# Altium schematic sheet 14 SENSORS.SchDoc
size 513 x 386 mm
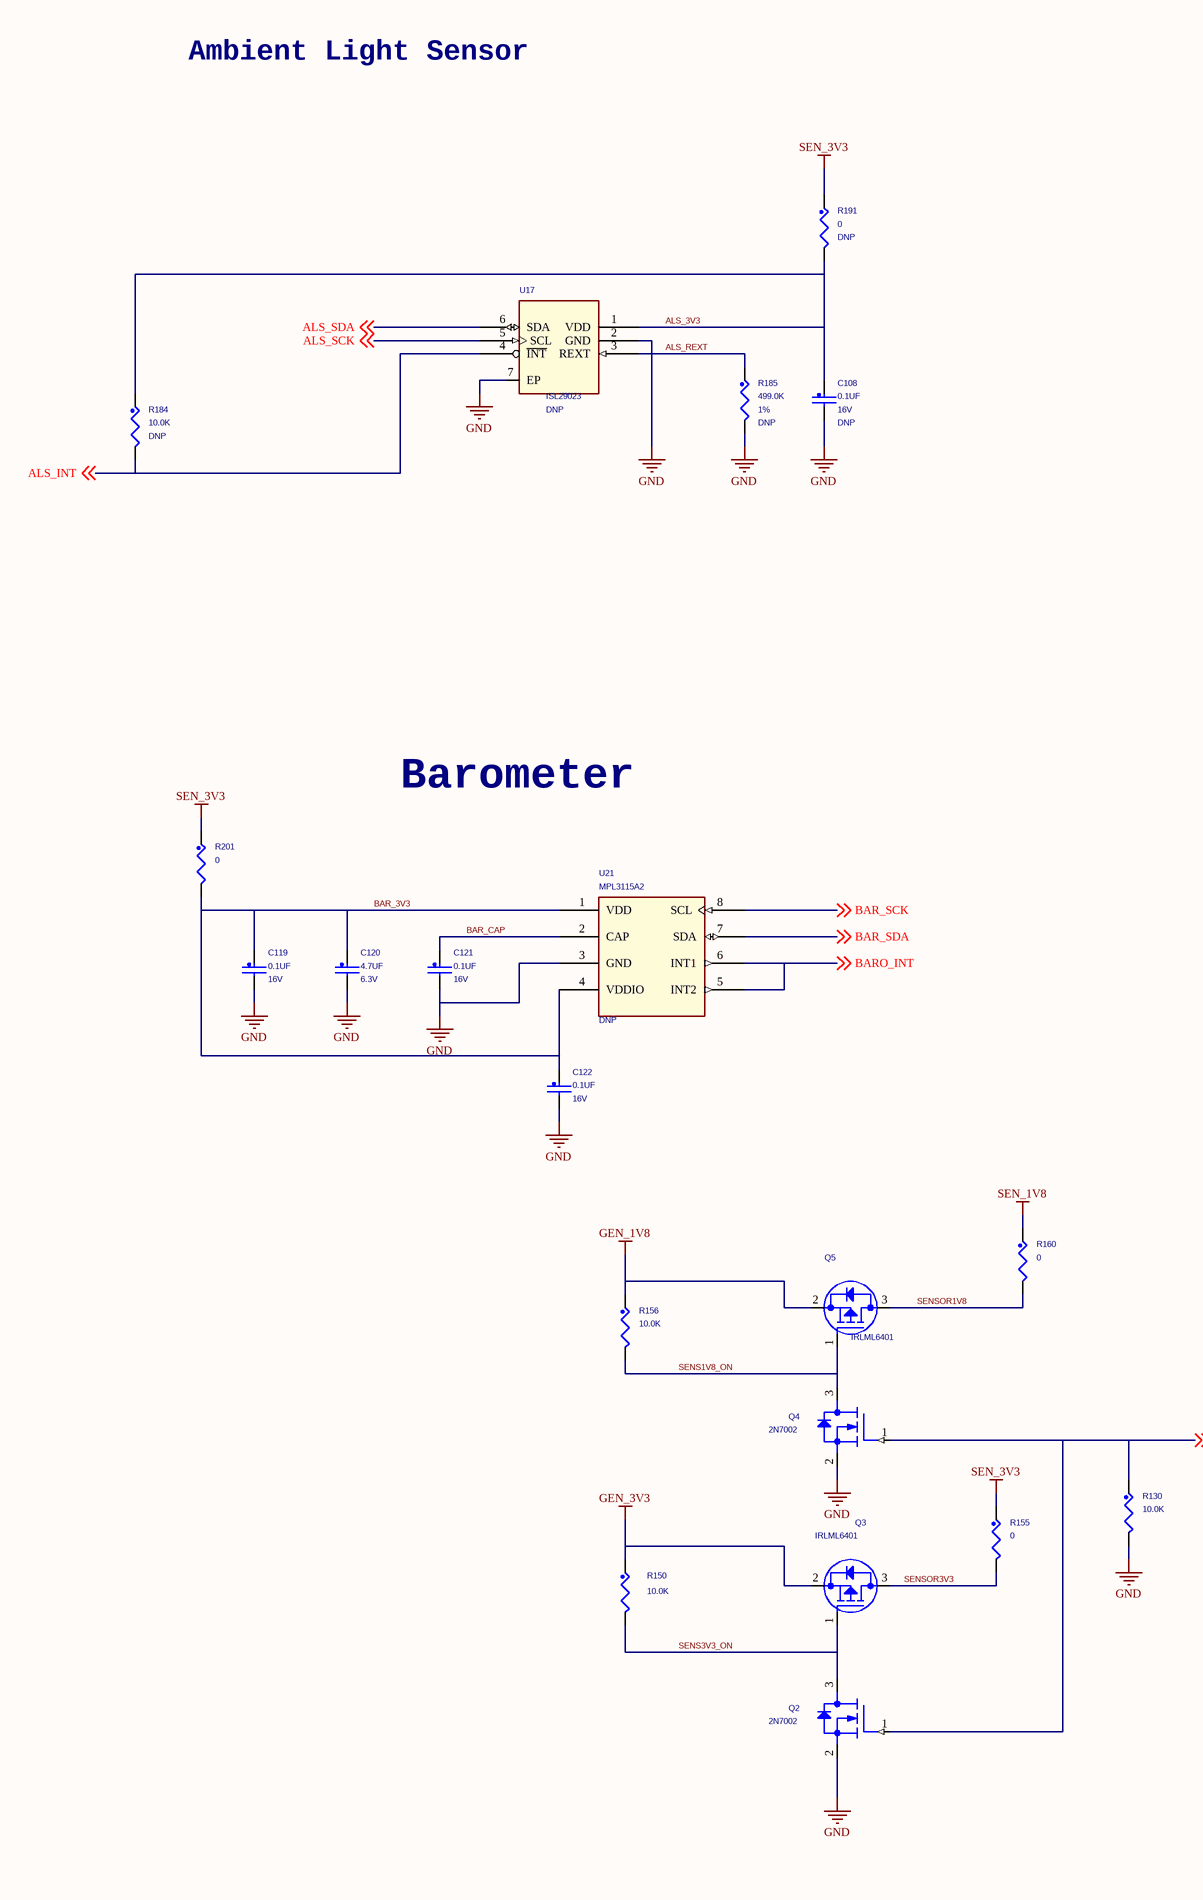
[diagram p0: 14 SENSORS.SchDoc, left]
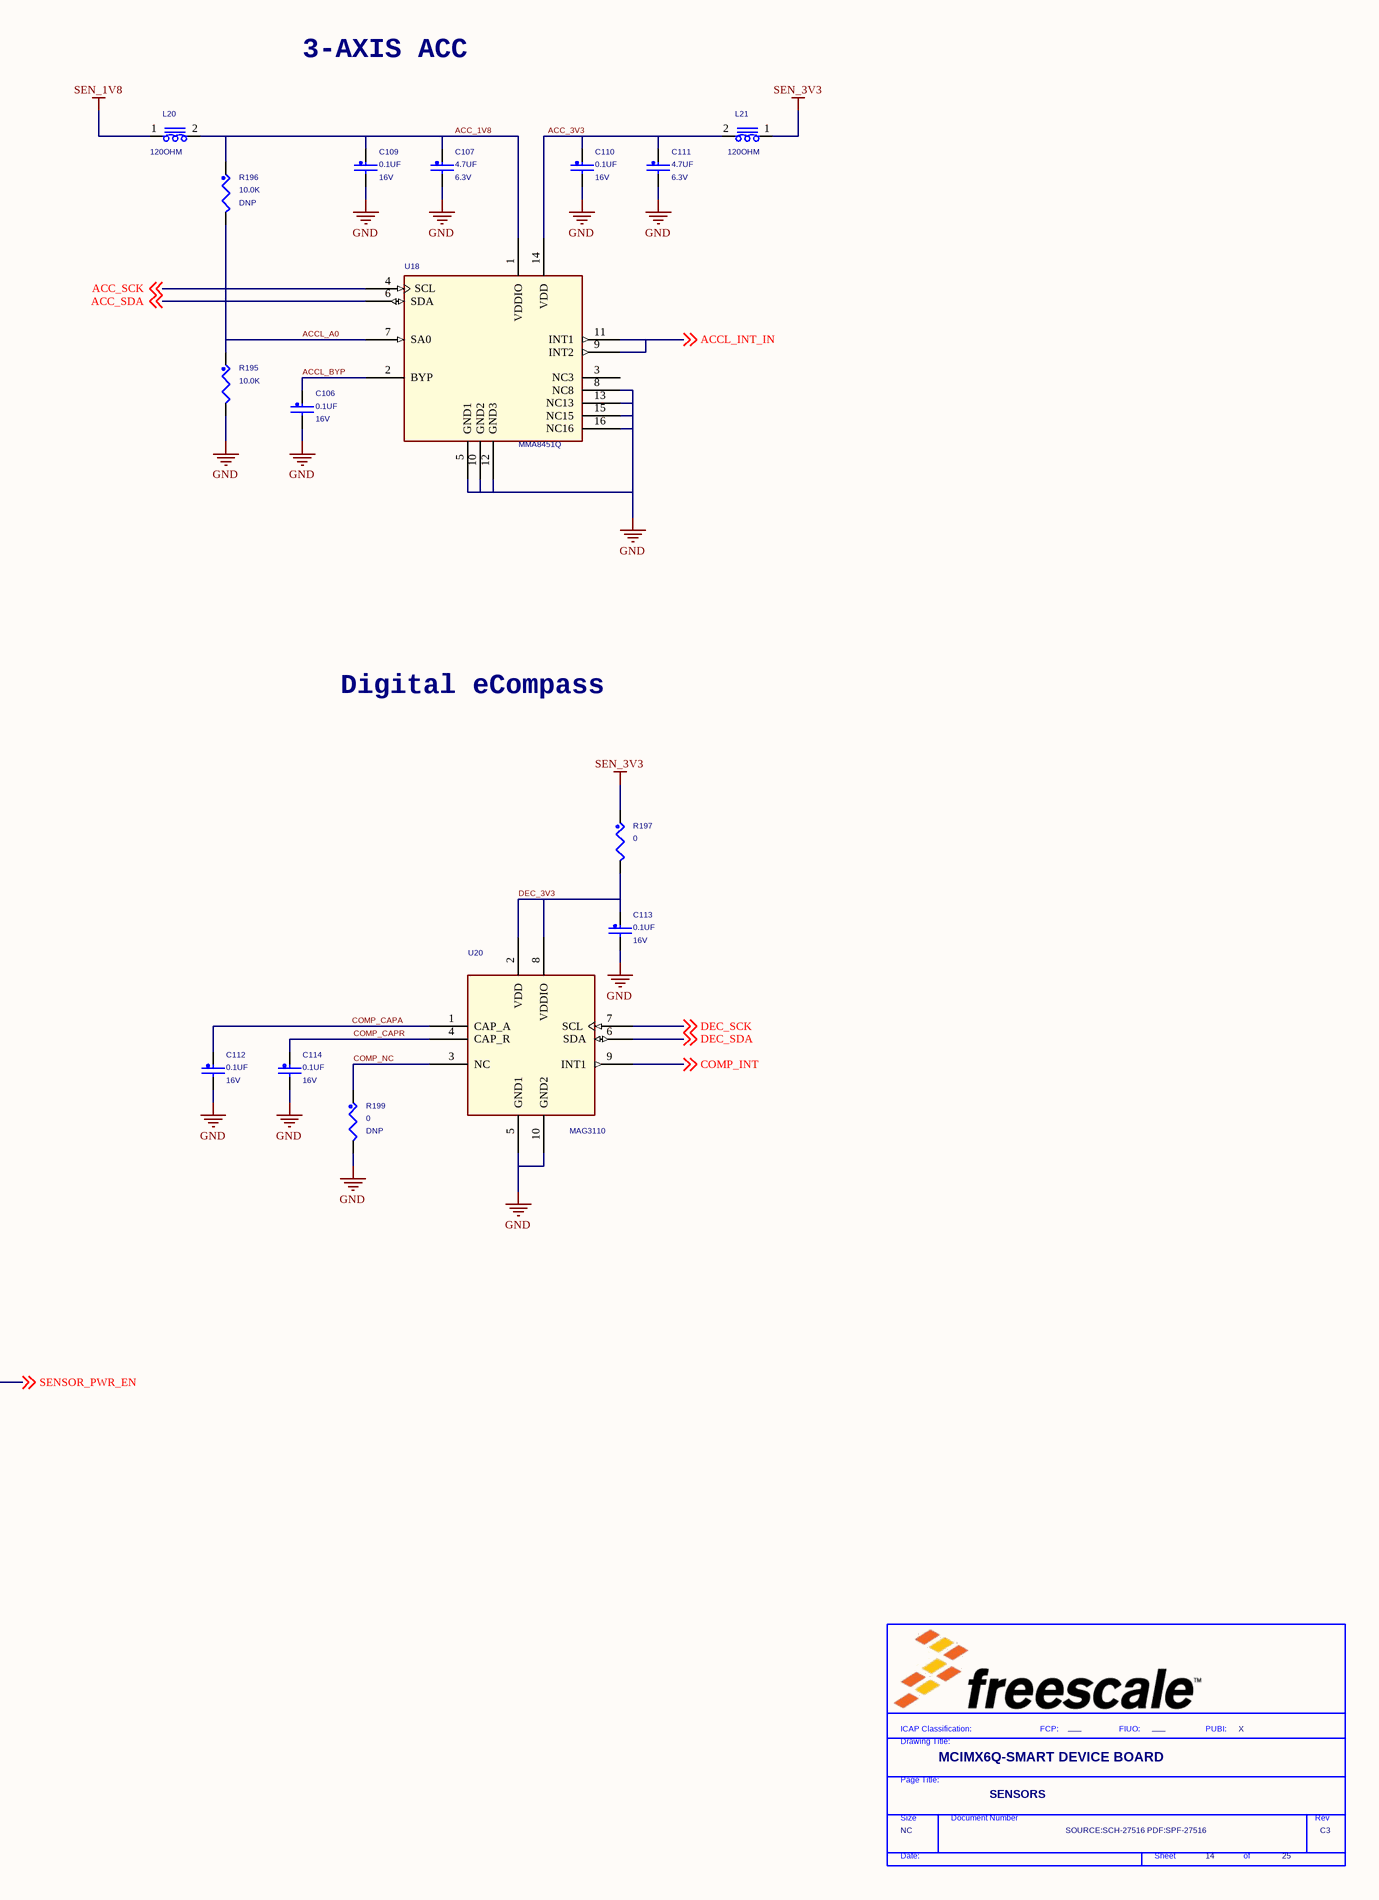
[diagram p1: 14 SENSORS.SchDoc, right]

## Parts
*  FIUO: ___  PUBI: X  Doc: SOURCE:SCH-27516 PDF:SPF-27516  RevCode: C3  Title: MCIMX6Q-SMART DEVICE BOARD  Page Size: NC  Page Number: 14  Page Count: 25  PageTitle: SENSORS  (hidden comment: TitleBlock_FS)  (graphical)
C106  0.1UF  WVDC: 16V  [0402_CC]
C107  4.7UF  WVDC: 6.3V  [0603_CC]
C108  0.1UF  ASSY_OPT: DNP  WVDC: 16V  [0402_CC]
C109  0.1UF  WVDC: 16V  [0402_CC]
C110  0.1UF  WVDC: 16V  [0402_CC]
C111  4.7UF  WVDC: 6.3V  [0603_CC]
C112  0.1UF  WVDC: 16V  [0402_CC]
C113  0.1UF  WVDC: 16V  [0402_CC]
C114  0.1UF  WVDC: 16V  [0402_CC]
C119  0.1UF  WVDC: 16V  [0402_CC]
C120  4.7UF  WVDC: 6.3V  [0603_CC]
C121  0.1UF  WVDC: 16V  [0402_CC]
C122  0.1UF  WVDC: 16V  [0402_CC]
L20  120OHM  [0603_CC]
L21  120OHM  [0603_CC]
Q2  2N7002  [SOT23]
Q3  IRLML6401  [sot-23]
Q4  2N7002  [SOT23]
Q5  IRLML6401  [sot-23]
R130  10.0K  [0402_CC]
R150  10.0K  [0402_CC]
R155  0  [0402_CC]
R156  10.0K  [0402_CC]
R160  0  [0402_CC]
R184  10.0K  ASSY_OPT: DNP  [0402_CC]
R185  499.0K  Tolerance: 1%  ASSY_OPT: DNP  [0603_CC]
R191  0  ASSY_OPT: DNP  [0402_CC]
R195  10.0K  [0402_CC]
R196  10.0K  ASSY_OPT: DNP  [0402_CC]
R197  0  [0402_CC]
R199  0  ASSY_OPT: DNP  [0402_CC]
R201  0  [0402_CC]
U17  ISL29023  ASSY_OPT: DNP  [dfn_6_0p65_2p1x2]
U18  MMA8451Q  [qfn5x3_0p5_3x3]
U20  MAG3110  [dfn_10_0p4_2x2]
U21  MPL3115A2  ASSY_OPT: DNP  [LGA8_1P25_3X5_0P5]

## Nets
GEN_1V8: Q5.2(SOURCE) R156.1
GEN_3V3: Q3.2(SOURCE) R150.1
GND: C106.2 C107.2 C108.2 C109.2 C110.2 C111.2 C112.2 C113.2 C114.2 C119.2 C120.2 C121.2 C122.2 Q2.2(SOURCE) Q4.2(SOURCE) R130.2 R185.2 R195.2 R199.2 U17.2(GND) U17.7(EP) U18.5(GND1) U18.8(NC8) U18.10(GND2) U18.12(GND3) U18.13(NC13) U18.15(NC15) U18.16(NC16) U20.5(GND1) U20.10(GND2) U21.3(GND)
SEN_1V8: L20.1 R160.1
SEN_3V3: L21.1 R155.1 R191.1 R197.1 R201.1
ACC_1V8: C107.1 C109.1 L20.2 R196.1 U18.1(VDDIO)
ACC_3V3: C110.1 C111.1 L21.2 U18.14(VDD)
ACC_SCK: U18.4(SCL) ; off-sheet ACC_SCK
ACC_SDA: U18.6(SDA) ; off-sheet ACC_SDA
ACCL_A0: R195.1 R196.2 U18.7(SA0)
ACCL_BYP: C106.1 U18.2(BYP)
ACCL_INT_IN: U18.9(INT2) U18.11(INT1) ; off-sheet ACCL_INT_IN
ALS_3V3: C108.1 R184.1 R191.2 U17.1(VDD)
ALS_INT: R184.2 U17.4(~{INT}) ; off-sheet ALS_INT
ALS_REXT: R185.1 U17.3(REXT)
ALS_SCK: U17.5(SCL) ; off-sheet ALS_SCK
ALS_SDA: U17.6(SDA) ; off-sheet ALS_SDA
BAR_3V3: C119.1 C120.1 C122.1 R201.2 U21.1(VDD) U21.4(VDDIO)
BAR_CAP: C121.1 U21.2(CAP)
BAR_SCK: U21.8(SCL) ; off-sheet BAR_SCK
BAR_SDA: U21.7(SDA) ; off-sheet BAR_SDA
BARO_INT: U21.5(INT2) U21.6(INT1) ; off-sheet BARO_INT
COMP_CAPA: C112.1 U20.1(CAP_A)
COMP_CAPR: C114.1 U20.4(CAP_R)
COMP_INT: U20.9(INT1) ; off-sheet COMP_INT
COMP_NC: R199.1 U20.3(NC)
DEC_3V3: C113.1 R197.2 U20.2(VDD) U20.8(VDDIO)
DEC_SCK: U20.7(SCL) ; off-sheet DEC_SCK
DEC_SDA: U20.6(SDA) ; off-sheet DEC_SDA
SENS1V8_ON: Q4.3(DRAIN) Q5.1(GATE) R156.2
SENS3V3_ON: Q2.3(DRAIN) Q3.1(GATE) R150.2
SENSOR1V8: Q5.3(DRAIN) R160.2
SENSOR3V3: Q3.3(DRAIN) R155.2
SENSOR_PWR_EN: Q2.1(GATE) Q4.1(GATE) R130.1 ; off-sheet SENSOR_PWR_EN

Not connected (* = marked no-connect by the designer): U18 3(NC3)

## Notes on the sheet
- Ambient Light Sensor
- 3-AXIS ACC
- Digital eCompass
- Barometer
- (in symbol TitleBlock_FS) ICAP Classification:; FCP:; FIUO:; PUBI:; Drawing Title:; Page Title:; Size; Document Number; Rev; Date:; Sheet; of

## Library data of the parts
* = TitleBlock_FS: OrgAddr2: Austin, TX 78735-8598; OrgAddr1: 6501 William Cannon Drive West; OrgName: Freescale Semiconductor; FCP: ___; Page Create Date: March  8, 1995
C106 C121 C122 = CAP_NP: CAP CER 0.1UF 16V 10% X7R 0402; CLASS: DISCRETE; FPLIST: CC0402_25,CC0402_HD,0402_CC; CAD_APPROVED: Yes; MFG_PN01: C0402C104K4RAC; MFG_NAME01: KEMET; AGILE_PN: 150-75182; SIGNAL_MODEL: DEFAULT_CAPACITOR_100000pF_2_1; HEIGHT: 0.635MM; ROHS: Yes; Tolerance: 10%; VOLTAGE: 16V
C107 C111 C120 = CAP_NP: CAP CER 4.7UF 6.3V 10% X5R 0603; CLASS: DISCRETE; AGILE_PN: 150-75487; MFG_NAME01: VENKEL COMPANY; MFG_PN01: C0603X5R6R3-475KNP; CAD_APPROVED: Yes; FPLIST: CC0603_OV,CC0603,0603_CC; SIGNAL_MODEL: DEFAULT_CAPACITOR_4.7e+06pF_2_1; Tolerance: 10%; ROHS: Yes; HEIGHT: 1.016MM; VOLTAGE: 6.3V
C108-C110 C112-C114 C119 = CAP_NP: CAP CER 0.1UF 16V 10% X7R 0402; CLASS: DISCRETE; AGILE_PN: 150-75182; MFG_NAME01: KEMET; MFG_PN01: C0402C104K4RAC; CAD_APPROVED: Yes; FPLIST: CC0402_25,CC0402_HD,0402_CC; SIGNAL_MODEL: DEFAULT_CAPACITOR_100000pF_2_1; Tolerance: 10%; ROHS: Yes; HEIGHT: 0.635MM; VOLTAGE: 16V
L20 = BEAD_0: IND FER BEAD 120OHM@100MHZ 2A 25% 0603; PART_TYPE: FERRITE; CLASS: DISCRETE; PRIORITY_PN: 024-00067; MFG_NAME01: MURATA; CAD_APPROVED: Yes; FPLIST: IND_0603,0603_CC; AGILE_PN: 180-30008; MFG_PN01: BLM18PG121SH1; ROOM: RGMII_PHY; Tolerance: 25%; HEIGHT: 0.95MM; ROHS: Yes
L21 = BEAD_0: IND FER BEAD 120OHM@100MHZ 2A 25% 0603; PART_TYPE: FERRITE; CLASS: DISCRETE; ROOM: RGMII_PHY; MFG_PN01: BLM18PG121SH1; AGILE_PN: 180-30008; FPLIST: IND_0603,0603_CC; CAD_APPROVED: Yes; MFG_NAME01: MURATA; PRIORITY_PN: 024-00067; ROHS: Yes; HEIGHT: 0.95MM; Tolerance: 25%
Q2 = 2N7002: TRAN NMOS 60V 115MA SOT23; CLASS: IC; CAD_APPROVED: Yes; MFG_PN01: 2N7002LT1G; MFG_NAME01: ON SEMICONDUCTOR; AGILE_PN: 480-75159; HEIGHT: 1.3MM; ROHS: Yes
Q3 Q5 = MOSFET_P: TRAN PMOS PWR 12V 4.3A SOT23; CLASS: IC; AGILE_PN: 480-77718; MFG_NAME01: INTERNATIONAL RECTIFIER; MFG_PN01: IRLML6401TRPBF; CAD_APPROVED: Yes; ROHS: Yes; HEIGHT: 1.12MM
Q4 = 2N7002: TRAN NMOS 60V 115MA SOT23; CLASS: IC; AGILE_PN: 480-75159; MFG_NAME01: ON SEMICONDUCTOR; MFG_PN01: 2N7002LT1G; CAD_APPROVED: Yes; ROHS: Yes; HEIGHT: 1.3MM
R130 = RES: RES MF 10.0K 1/16W 1% 0402; CLASS: DISCRETE; AGILE_PN: 470-75416; MFG_NAME01: VISHAY INTERTECHNOLOGY; MFG_PN01: CRCW040210K0FKED; CAD_APPROVED: Yes; FPLIST: RC0402_25,RC0402_HD,0402_CC; SIGNAL_MODEL: DEFAULT_RESISTOR_10000OHM_2_1; Tolerance: 1%; ROHS: Yes
R150 R156 R184 R195 R196 = RES: RES MF 10.0K 1/16W 1% 0402; CLASS: DISCRETE; FPLIST: RC0402_25,RC0402_HD,0402_CC; CAD_APPROVED: Yes; MFG_PN01: CRCW040210K0FKED; MFG_NAME01: VISHAY INTERTECHNOLOGY; AGILE_PN: 470-75416; SIGNAL_MODEL: DEFAULT_RESISTOR_10000OHM_2_1; ROHS: Yes; Tolerance: 1%
R155 R160 R201 = RES: RES MF ZERO OHM 1/10W -- 0402; CLASS: DISCRETE; FPLIST: RC0402_25,RC0402_HD,RC0402_X2,0402_CC; CAD_APPROVED: Yes; MFG_PN01: ERJ-2GE0R00X; MFG_NAME01: Panasonic; AGILE_PN: 470-79965; SIGNAL_MODEL: DEFAULT_RESISTOR_0.001OHM_2_1; ROHS: Yes
R185 = RES: RES MF 499.0K 1/10W 1% 0603; CLASS: DISCRETE; AGILE_PN: 470-78155; MFG_NAME01: KOA SPEER; MFG_PN01: RK73H1JTTD4993F; CAD_APPROVED: Yes; FPLIST: RC0603_OV,RC0603,0603_CC; SIGNAL_MODEL: DEFAULT_RESISTOR_499000OHM_2_1; ROHS: Yes
R191 R197 R199 = RES: RES MF ZERO OHM 1/10W -- 0402; CLASS: DISCRETE; AGILE_PN: 470-79965; MFG_NAME01: Panasonic; MFG_PN01: ERJ-2GE0R00X; CAD_APPROVED: Yes; FPLIST: RC0402_25,RC0402_HD,RC0402_X2,0402_CC; SIGNAL_MODEL: DEFAULT_RESISTOR_0.001OHM_2_1; ROHS: Yes
U17 = ISL29023: IC LIGHT SENSOR I2C 16-BIT 2.25-3.63V ODFN6; AGILE_PN: 315-79130; MFG_NAME01: Intersil; MFG_PN01: ISL29023IROZ-T7; CAD_APPROVED: Yes; CLASS: IC; ROHS: Yes; HEIGHT: 0.75MM
U18 = MMA8451Q_16P_A: IC 3-AXIS DIG ACCELEROMETER 14/8BIT 1.95-3.6V QFN16; FPLIST: qfn5x3_0p5_3x3,qfn16_0p5_3p03x3p03; CAD_APPROVED: Yes; MFG_PN01: MMA8451QT; MFG_NAME01: FREESCALE SEMICONDUCTOR; AGILE_PN: 315-79075; CLASS: IC; HEIGHT: 1MM; ROHS: Yes
U20 = MAG3112_DFN_10P: IC 3-AXIS DIGITAL MAGNETOMETER 1.95-3.6V DFN10; CAD_APPROVED: Yes; MFG_PN01: MAG3110FC; MFG_NAME01: FREESCALE SEMICONDUCTOR; AGILE_PN: 312-79970; CLASS: IC; HEIGHT: 0.9MM; ROHS: Yes
U21 = PPL3115A2_LGA_8P: IC ALTIMETER I2C 50-115KPA 1.96-3.6V LGA8; CAD_APPROVED: Yes; MFG_NAME01: FREESCALE SEMICONDUCTOR; AGILE_PN: 315-79136; CLASS: IC; HEIGHT: 1.2MM; ROHS: Yes; MFG_PN01: MPL3115A2